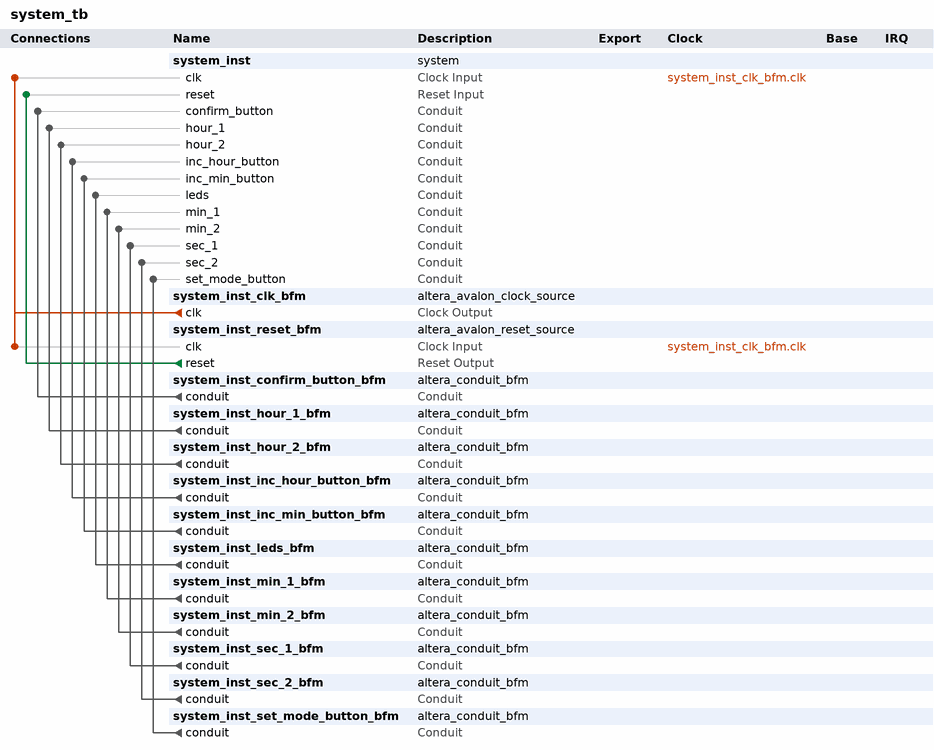
[diagram p0: system contents]
# Platform Designer (Qsys) system system_tb, Cyclone V 5CSEMA5F31C6
# Parameters at their usual value, and those the tool derives, are not listed.
package require -exact qsys 19.1
create_system system_tb
set_project_property DEVICE_FAMILY {Cyclone V}
set_project_property DEVICE 5CSEMA5F31C6

add_instance system_inst system 1.0

add_instance system_inst_clk_bfm altera_avalon_clock_source 19.1

add_instance system_inst_reset_bfm altera_avalon_reset_source 19.1
set_instance_parameter_value system_inst_reset_bfm ASSERT_HIGH_RESET 0
set_instance_parameter_value system_inst_reset_bfm INITIAL_RESET_CYCLES 50

add_instance system_inst_confirm_button_bfm altera_conduit_bfm 19.1
set_instance_parameter_value system_inst_confirm_button_bfm CLOCKED_SIGNAL false
set_instance_parameter_value system_inst_confirm_button_bfm ENABLE_RESET false
set_instance_parameter_value system_inst_confirm_button_bfm SIGNAL_DIRECTIONS output
set_instance_parameter_value system_inst_confirm_button_bfm SIGNAL_WIDTHS 1

add_instance system_inst_hour_1_bfm altera_conduit_bfm 19.1
set_instance_parameter_value system_inst_hour_1_bfm CLOCKED_SIGNAL false
set_instance_parameter_value system_inst_hour_1_bfm ENABLE_RESET false
set_instance_parameter_value system_inst_hour_1_bfm SIGNAL_DIRECTIONS input
set_instance_parameter_value system_inst_hour_1_bfm SIGNAL_WIDTHS 7

add_instance system_inst_hour_2_bfm altera_conduit_bfm 19.1
set_instance_parameter_value system_inst_hour_2_bfm CLOCKED_SIGNAL false
set_instance_parameter_value system_inst_hour_2_bfm ENABLE_RESET false
set_instance_parameter_value system_inst_hour_2_bfm SIGNAL_DIRECTIONS input
set_instance_parameter_value system_inst_hour_2_bfm SIGNAL_WIDTHS 7

add_instance system_inst_inc_hour_button_bfm altera_conduit_bfm 19.1
set_instance_parameter_value system_inst_inc_hour_button_bfm CLOCKED_SIGNAL false
set_instance_parameter_value system_inst_inc_hour_button_bfm ENABLE_RESET false
set_instance_parameter_value system_inst_inc_hour_button_bfm SIGNAL_DIRECTIONS output
set_instance_parameter_value system_inst_inc_hour_button_bfm SIGNAL_WIDTHS 1

add_instance system_inst_inc_min_button_bfm altera_conduit_bfm 19.1
set_instance_parameter_value system_inst_inc_min_button_bfm CLOCKED_SIGNAL false
set_instance_parameter_value system_inst_inc_min_button_bfm ENABLE_RESET false
set_instance_parameter_value system_inst_inc_min_button_bfm SIGNAL_DIRECTIONS output
set_instance_parameter_value system_inst_inc_min_button_bfm SIGNAL_WIDTHS 1

add_instance system_inst_leds_bfm altera_conduit_bfm 19.1
set_instance_parameter_value system_inst_leds_bfm CLOCKED_SIGNAL false
set_instance_parameter_value system_inst_leds_bfm ENABLE_RESET false
set_instance_parameter_value system_inst_leds_bfm SIGNAL_DIRECTIONS input
set_instance_parameter_value system_inst_leds_bfm SIGNAL_WIDTHS 10

add_instance system_inst_min_1_bfm altera_conduit_bfm 19.1
set_instance_parameter_value system_inst_min_1_bfm CLOCKED_SIGNAL false
set_instance_parameter_value system_inst_min_1_bfm ENABLE_RESET false
set_instance_parameter_value system_inst_min_1_bfm SIGNAL_DIRECTIONS input
set_instance_parameter_value system_inst_min_1_bfm SIGNAL_WIDTHS 7

add_instance system_inst_min_2_bfm altera_conduit_bfm 19.1
set_instance_parameter_value system_inst_min_2_bfm CLOCKED_SIGNAL false
set_instance_parameter_value system_inst_min_2_bfm ENABLE_RESET false
set_instance_parameter_value system_inst_min_2_bfm SIGNAL_DIRECTIONS input
set_instance_parameter_value system_inst_min_2_bfm SIGNAL_WIDTHS 7

add_instance system_inst_sec_1_bfm altera_conduit_bfm 19.1
set_instance_parameter_value system_inst_sec_1_bfm CLOCKED_SIGNAL false
set_instance_parameter_value system_inst_sec_1_bfm ENABLE_RESET false
set_instance_parameter_value system_inst_sec_1_bfm SIGNAL_DIRECTIONS input
set_instance_parameter_value system_inst_sec_1_bfm SIGNAL_WIDTHS 7

add_instance system_inst_sec_2_bfm altera_conduit_bfm 19.1
set_instance_parameter_value system_inst_sec_2_bfm CLOCKED_SIGNAL false
set_instance_parameter_value system_inst_sec_2_bfm ENABLE_RESET false
set_instance_parameter_value system_inst_sec_2_bfm SIGNAL_DIRECTIONS input
set_instance_parameter_value system_inst_sec_2_bfm SIGNAL_WIDTHS 7

add_instance system_inst_set_mode_button_bfm altera_conduit_bfm 19.1
set_instance_parameter_value system_inst_set_mode_button_bfm CLOCKED_SIGNAL false
set_instance_parameter_value system_inst_set_mode_button_bfm ENABLE_RESET false
set_instance_parameter_value system_inst_set_mode_button_bfm SIGNAL_DIRECTIONS output
set_instance_parameter_value system_inst_set_mode_button_bfm SIGNAL_WIDTHS 1

# connections
add_connection system_inst_clk_bfm.clk system_inst.clk clock
add_connection system_inst_clk_bfm.clk system_inst_reset_bfm.clk clock
add_connection system_inst_reset_bfm.reset system_inst.reset reset
add_connection system_inst_confirm_button_bfm.conduit system_inst.confirm_button conduit
add_connection system_inst_hour_1_bfm.conduit system_inst.hour_1 conduit
add_connection system_inst_hour_2_bfm.conduit system_inst.hour_2 conduit
add_connection system_inst_inc_hour_button_bfm.conduit system_inst.inc_hour_button conduit
add_connection system_inst_inc_min_button_bfm.conduit system_inst.inc_min_button conduit
add_connection system_inst_leds_bfm.conduit system_inst.leds conduit
add_connection system_inst_min_1_bfm.conduit system_inst.min_1 conduit
add_connection system_inst_min_2_bfm.conduit system_inst.min_2 conduit
add_connection system_inst_sec_1_bfm.conduit system_inst.sec_1 conduit
add_connection system_inst_sec_2_bfm.conduit system_inst.sec_2 conduit
add_connection system_inst_set_mode_button_bfm.conduit system_inst.set_mode_button conduit

set_interconnect_requirement {$system} qsys_mm.clockCrossingAdapter HANDSHAKE
set_interconnect_requirement {$system} qsys_mm.enableEccProtection FALSE
set_interconnect_requirement {$system} qsys_mm.insertDefaultSlave FALSE
set_interconnect_requirement {$system} qsys_mm.maxAdditionalLatency 1

save_system system_tb.qsys
